# Altium schematic sheet Int_Hub.SchDoc
size A4
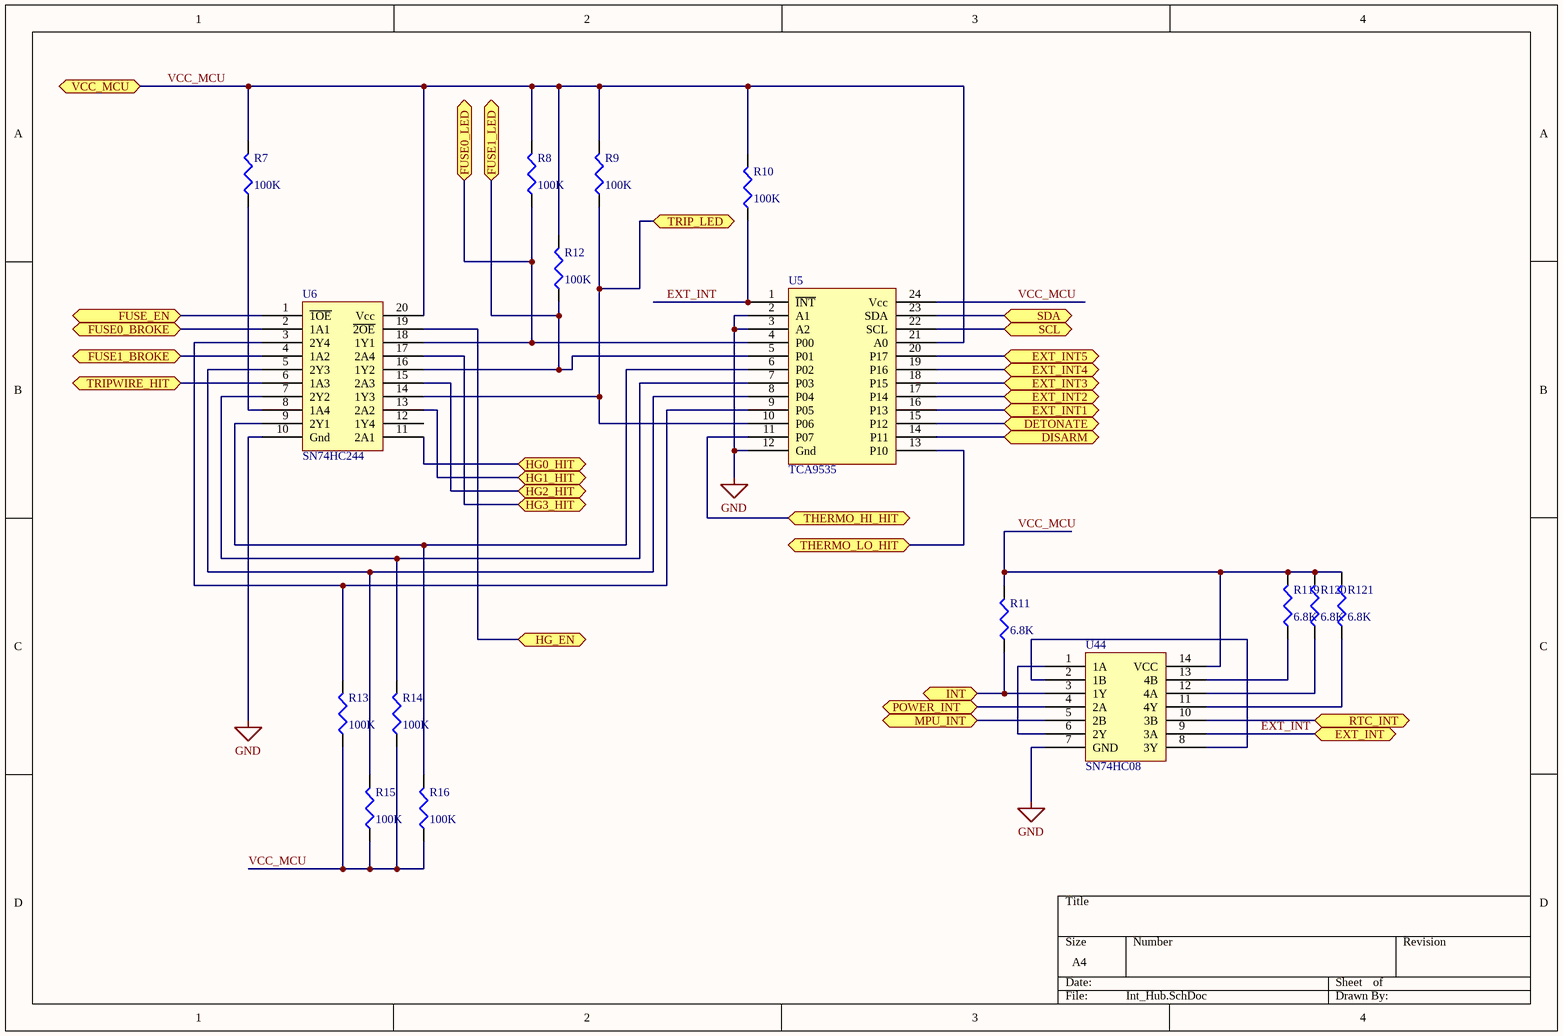
[diagram p0: Int_Hub.SchDoc]

## Parts
R7  value 100K  [0603]  (hidden comment: Res3)
R8  value 100K  [0603]  (hidden comment: Res3)
R9  value 100K  [0603]  (hidden comment: Res3)
R10  value 100K  [0603]  (hidden comment: Res3)
R11  value 6.8K  [0603]  (hidden comment: Res3)
R12  value 100K  [0603]  (hidden comment: Res3)
R13  value 100K  [0603]  (hidden comment: Res3)
R14  value 100K  [0603]  (hidden comment: Res3)
R15  value 100K  [0603]  (hidden comment: Res3)
R16  value 100K  [0603]  (hidden comment: Res3)
R119  value 6.8K  [0603]  (hidden comment: Res3)
R120  value 6.8K  [0603]  (hidden comment: Res3)
R121  value 6.8K  [0603]  (hidden comment: Res3)
U5  TCA9535  [TSSOP24]
U6  SN74HC244  [TSSOP20]
U44  SN74HC08  [TSSOP14]

## Ports
DETONATE (bidir), DISARM (bidir), EXT_INT1 (bidir), EXT_INT2 (bidir), EXT_INT3 (bidir), EXT_INT4 (bidir), EXT_INT5 (bidir), EXT_INT (bidir), FUSE0_BROKE (bidir), FUSE0_LED (bidir), FUSE1_BROKE (bidir), FUSE1_LED (bidir), FUSE_EN (bidir), HG0_HIT (bidir), HG1_HIT (bidir), HG2_HIT (bidir), HG3_HIT (bidir), HG_EN (bidir), INT (bidir), MPU_INT (bidir), POWER_INT (bidir), RTC_INT (bidir), SCL (bidir), SDA (bidir), THERMO_HI_HIT (bidir), THERMO_LO_HIT (bidir), TRIP_LED (bidir), TRIPWIRE_HIT (bidir), VCC_MCU (bidir)

## Nets
GND: U5.2(A1) U5.3(A2) U5.12(Gnd) U6.10(Gnd) U44.7(GND)
DETONATE: U5.15(P12) ; port DETONATE
DISARM: U5.14(P11) ; port DISARM
EXT_INT: R10.1 U5.1(~{INT}) U44.9(3A) ; port EXT_INT
EXT_INT1: U5.16(P13) ; port EXT_INT1
EXT_INT2: U5.17(P14) ; port EXT_INT2
EXT_INT3: U5.18(P15) ; port EXT_INT3
EXT_INT4: U5.19(P16) ; port EXT_INT4
EXT_INT5: U5.20(P17) ; port EXT_INT5
FUSE0_BROKE: U6.2(1A1) ; port FUSE0_BROKE
FUSE0_LED: R8.1 U5.4(P00) U6.18(1Y1) ; port FUSE0_LED
FUSE1_BROKE: U6.4(1A2) ; port FUSE1_BROKE
FUSE1_LED: R12.1 U5.5(P01) U6.16(1Y2) ; port FUSE1_LED
FUSE_EN: U6.1(~{1OE}) ; port FUSE_EN
HG0_HIT: U6.11(2A1) ; port HG0_HIT
HG1_HIT: U6.13(2A2) ; port HG1_HIT
HG2_HIT: U6.15(2A3) ; port HG2_HIT
HG3_HIT: U6.17(2A4) ; port HG3_HIT
HG_EN: U6.19(~{2OE}) ; port HG_EN
INT: R11.1 U44.3(1Y) ; port INT
MPU_INT: U44.5(2B) ; port MPU_INT
POWER_INT: U44.4(2A) ; port POWER_INT
RTC_INT: U44.10(3B) ; port RTC_INT
SCL: U5.22(SCL) ; port SCL
SDA: U5.23(SDA) ; port SDA
THERMO_HI_HIT: U5.11(P07) ; port THERMO_HI_HIT
THERMO_LO_HIT: U5.13(P10) ; port THERMO_LO_HIT
TRIP_LED: R9.1 U5.10(P06) U6.14(1Y3) ; port TRIP_LED
TRIPWIRE_HIT: U6.6(1A3) ; port TRIPWIRE_HIT
VCC_MCU: R7.2 R8.2 R9.2 R10.2 R11.2 R12.2 R13.1 R14.1 R15.1 R16.1 R119.2 R120.2 R121.2 U5.21(A0) U5.24(Vcc) U6.20(Vcc) U44.14(VCC) ; port VCC_MCU
NetR7_1: R7.1 U6.8(1A4)
NetR13_2: R13.2 U5.9(P05) U6.3(2Y4)
NetR14_2: R14.2 U5.7(P03) U6.7(2Y2)
NetR15_2: R15.2 U5.8(P04) U6.5(2Y3)
NetR16_2: R16.2 U5.6(P02) U6.9(2Y1)
NetR119_1: R119.1 U44.13(4B)
NetR120_1: R120.1 U44.12(4A)
NetR121_1: R121.1 U44.11(4Y)
NetU44_1: U44.1(1A) U44.6(2Y)
NetU44_2: U44.2(1B) U44.8(3Y)

Not connected (* = marked no-connect by the designer): U6 12(1Y4)

## Library data of the parts
R7-R16 R119-R121 = Res3: Resistor; Published: 8-Jun-2000; LatestRevisionDate: 29-May-2009; LatestRevisionNote: IPC-7351 Footprint Added.; PackageReference: J1-0603; Publisher: Altium Limited; PackageDescription: Chip Resistor